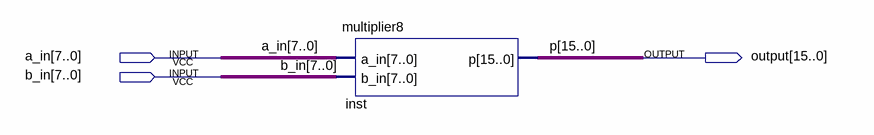
[diagram p0: schematic sheet]
// Quartus schematic nultiplier8.bdf as structural Verilog: 1 symbols, 3 pins
module nultiplier8 (
  input  [7:0] a_in,
  input  [7:0] b_in,
  output [15:0] \output 
);

  multiplier8 inst (.a_in(a_in), .b_in(b_in), .p(\output ));

  // Other names for the same wires on the sheet: p[15:0] = \output 
endmodule
